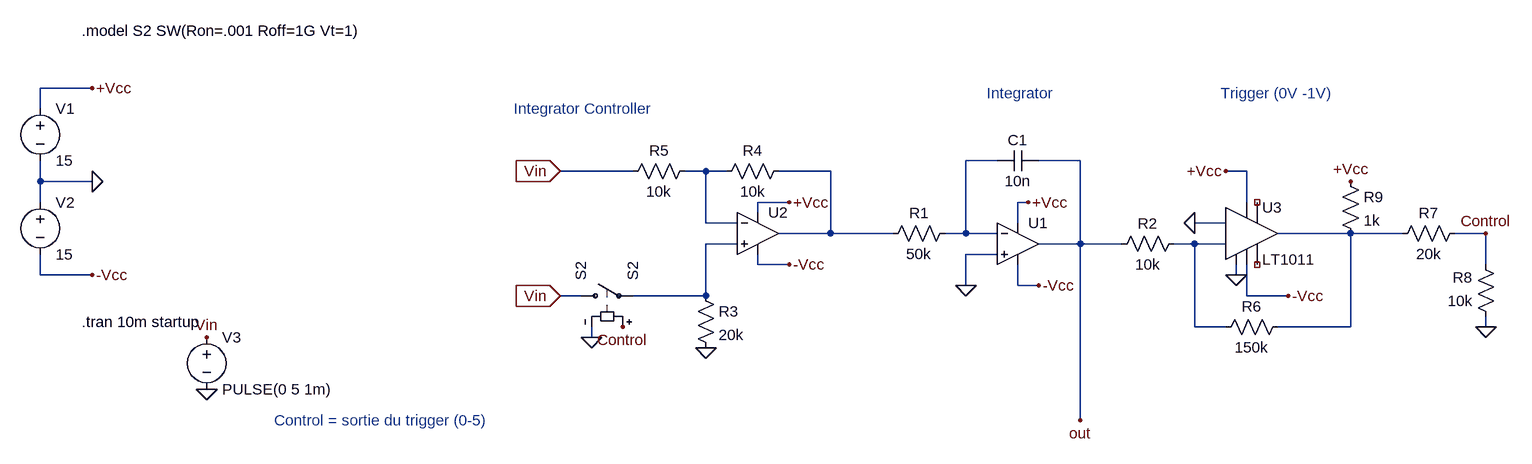
[diagram p0: schematic Integrator Controller.asc]
Integrator Controller.asc, the LTspice schematic file:
Version 4
SHEET 1 1856 680
WIRE -352 -16 -432 -16
WIRE -432 16 -432 -16
WIRE 1040 96 992 96
WIRE 1168 96 1104 96
WIRE 480 112 368 112
WIRE 592 112 560 112
WIRE 624 112 592 112
WIRE 784 112 704 112
WIRE 1424 112 1392 112
WIRE -432 128 -432 96
WIRE -352 128 -432 128
WIRE -432 160 -432 128
WIRE 720 160 672 160
WIRE 1088 160 1072 160
WIRE 1424 160 1424 112
WIRE 672 176 672 160
WIRE 592 192 592 112
WIRE 640 192 592 192
WIRE 1072 192 1072 160
WIRE 1392 192 1344 192
WIRE 784 208 784 112
WIRE 784 208 704 208
WIRE 880 208 784 208
WIRE 992 208 992 96
WIRE 992 208 960 208
WIRE 1040 208 992 208
WIRE 1584 208 1472 208
WIRE 1664 208 1584 208
WIRE 1792 208 1744 208
WIRE 640 224 592 224
WIRE 1168 224 1168 96
WIRE 1168 224 1104 224
WIRE 1232 224 1168 224
WIRE 1344 224 1312 224
WIRE 1392 224 1344 224
WIRE 1040 240 992 240
WIRE 672 256 672 240
WIRE 720 256 672 256
WIRE 1792 256 1792 208
WIRE -432 272 -432 240
WIRE -352 272 -432 272
WIRE 1408 272 1408 256
WIRE 992 288 992 240
WIRE 1072 288 1072 256
WIRE 1104 288 1072 288
WIRE 400 304 368 304
WIRE 592 304 592 224
WIRE 592 304 480 304
WIRE 1424 304 1424 256
WIRE 1488 304 1424 304
WIRE 1344 352 1344 224
WIRE 1392 352 1344 352
WIRE 1584 352 1584 208
WIRE 1584 352 1472 352
WIRE 1792 352 1792 336
WIRE 416 368 416 352
WIRE 1168 496 1168 224
FLAG 368 112 Vin
IOPIN 368 112 In
FLAG 368 304 Vin
IOPIN 368 304 In
FLAG 416 368 0
FLAG 464 352 Control
FLAG -352 -16 +Vcc
FLAG -352 272 -Vcc
FLAG -352 128 0
FLAG -176 448 0
FLAG -176 368 Vin
FLAG 592 384 0
FLAG 720 160 +Vcc
FLAG 720 256 -Vcc
FLAG 992 288 0
FLAG 1088 160 +Vcc
FLAG 1104 288 -Vcc
FLAG 1408 272 0
FLAG 1392 112 +Vcc
FLAG 1488 304 -Vcc
FLAG 1792 352 0
FLAG 1792 208 Control
FLAG 1344 192 0
FLAG 1168 496 out
FLAG 1584 128 +Vcc
SYMBOL sw 384 304 R270
SYMATTR InstName S2
SYMATTR Value S2
SYMBOL voltage -432 0 R0
WINDOW 123 0 0 Left 2
WINDOW 39 0 0 Left 2
SYMATTR InstName V1
SYMATTR Value 15
SYMBOL voltage -432 144 R0
WINDOW 123 0 0 Left 2
WINDOW 39 0 0 Left 2
SYMATTR InstName V2
SYMATTR Value 15
SYMBOL voltage -176 352 R0
WINDOW 123 0 0 Left 2
WINDOW 39 0 0 Left 2
SYMATTR InstName V3
SYMATTR Value PULSE(0 5 1m)
SYMBOL Opamps\\UniversalOpamp2 672 208 R0
SYMATTR InstName U2
SYMBOL res 576 96 R90
WINDOW 0 0 56 VBottom 2
WINDOW 3 32 56 VTop 2
SYMATTR InstName R5
SYMATTR Value 10k
SYMATTR SpiceLine tol=5
SYMBOL res 576 288 R0
SYMATTR InstName R3
SYMATTR Value 20k
SYMATTR SpiceLine tol=5
SYMBOL res 720 96 R90
WINDOW 0 0 56 VBottom 2
WINDOW 3 32 56 VTop 2
SYMATTR InstName R4
SYMATTR Value 10k
SYMATTR SpiceLine tol=5
SYMBOL Opamps\\UniversalOpamp2 1072 224 R0
SYMATTR InstName U1
SYMBOL cap 1104 80 R90
WINDOW 0 0 32 VBottom 2
WINDOW 3 32 32 VTop 2
SYMATTR InstName C1
SYMATTR Value 10n
SYMBOL res 976 192 R90
WINDOW 0 0 56 VBottom 2
WINDOW 3 32 56 VTop 2
SYMATTR InstName R1
SYMATTR Value 50k
SYMATTR SpiceLine tol=5
SYMBOL Comparators\\LT1011 1424 208 R0
SYMATTR InstName U3
SYMBOL res 1328 208 R90
WINDOW 0 0 56 VBottom 2
WINDOW 3 32 56 VTop 2
SYMATTR InstName R2
SYMATTR Value 10k
SYMATTR SpiceLine tol=5
SYMBOL res 1488 336 R90
WINDOW 0 0 56 VBottom 2
WINDOW 3 32 56 VTop 2
SYMATTR InstName R6
SYMATTR Value 150k
SYMATTR SpiceLine tol=5
SYMBOL res 1760 192 R90
WINDOW 0 0 56 VBottom 2
WINDOW 3 32 56 VTop 2
SYMATTR InstName R7
SYMATTR Value 20k
SYMATTR SpiceLine tol=5
SYMBOL res 1808 352 R180
WINDOW 0 36 76 Left 2
WINDOW 3 36 40 Left 2
SYMATTR InstName R8
SYMATTR Value 10k
SYMATTR SpiceLine tol=5
SYMBOL res 1568 112 R0
SYMATTR InstName R9
SYMATTR Value 1k
SYMATTR SpiceLine tol=5
TEXT -368 344 Left 2 !.tran 10m startup
TEXT -368 -104 Left 2 !.model S2 SW(Ron=.001 Roff=1G Vt=1)
TEXT -72 496 Left 2 ;Control = sortie du trigger (0-5)
TEXT 296 16 Left 2 ;Integrator Controller
TEXT 1024 -8 Left 2 ;Integrator
TEXT 1384 -8 Left 2 ;Trigger (0V -1V)

The netlist it stands for:
* Integrator Controller.asc
S2 Vin N005 Control 0 S2
V1 +Vcc 0 15
V2 0 -Vcc 15
V3 Vin 0 PULSE(0 5 1m)
XU2 N005 N002 +Vcc -Vcc N003 level.2 Avol=1Meg GBW=10Meg Slew=10Meg ilimit=25m rail=0 Vos=0 phimargin=45 en=0 enk=0 in=0 ink=0 Rin=500Meg  ; pins IN+ IN- V+ V- OUT
R5 N002 Vin 10k tol=5
R3 N005 0 20k tol=5
R4 N003 N002 10k tol=5
XU1 0 N001 +Vcc -Vcc out level.2 Avol=1Meg GBW=10Meg Slew=10Meg ilimit=25m rail=0 Vos=0 phimargin=45 en=0 enk=0 in=0 ink=0 Rin=500Meg  ; pins IN+ IN- V+ V- OUT
C1 out N001 10n
R1 N001 N003 50k tol=5
XU3 0 N006 0 -Vcc NC_01 NC_02 N004 +Vcc LT1011
R2 N006 out 10k tol=5
R6 N004 N006 150k tol=5
R7 Control N004 20k tol=5
R8 0 Control 10k tol=5
R9 +Vcc N004 1k tol=5
.tran 10m startup
.model S2 SW(Ron=.001 Roff=1G Vt=1)
* Control = sortie du trigger (0-5)
* Integrator Controller
* Integrator
* Trigger (0V -1V)
.lib UniversalOpamps2.sub
.lib LTC1.lib
.backanno
.end